# EAGLE design chipchestra-v05-buttons (EAGLE 8.0.1)
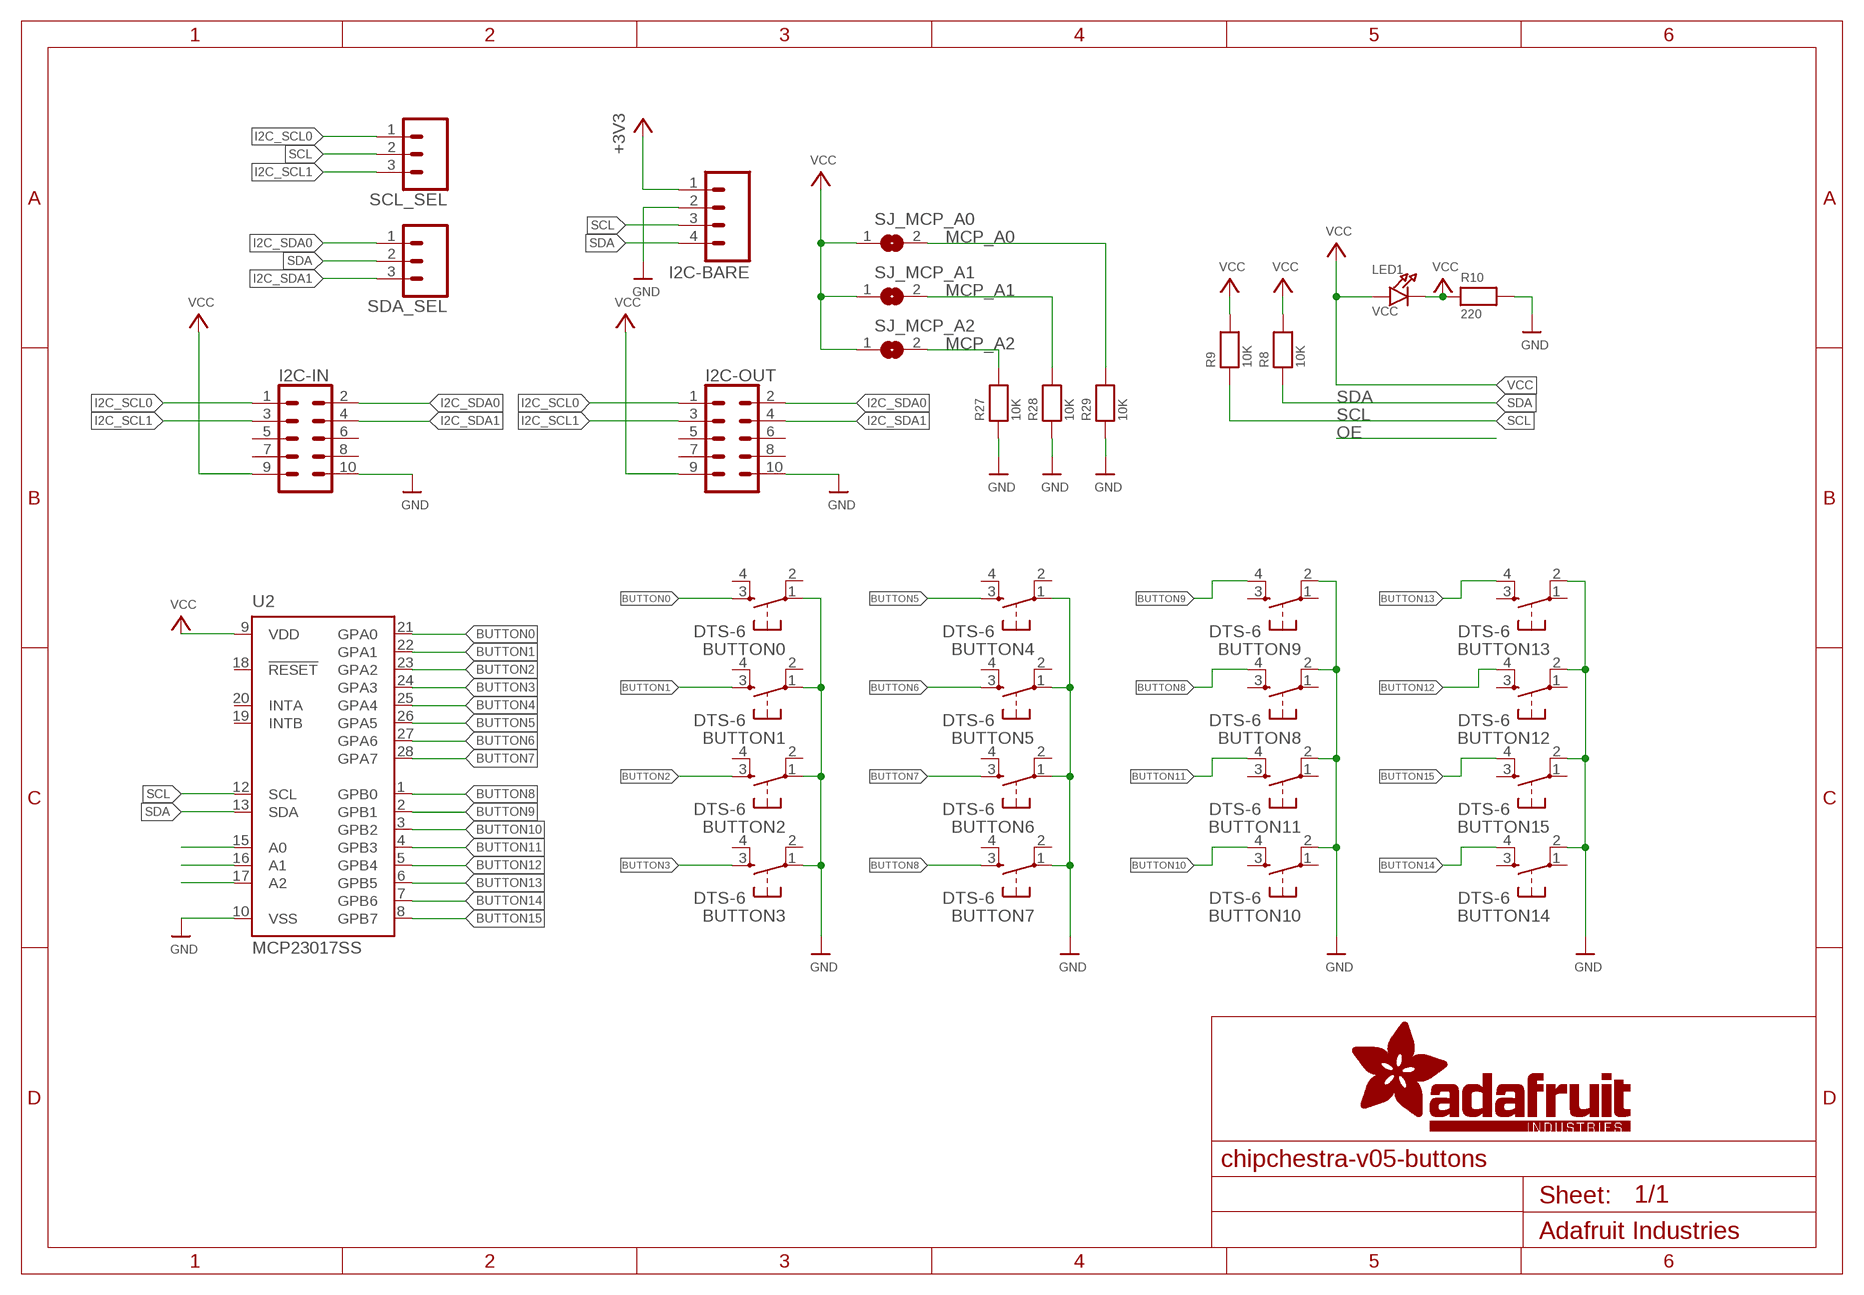
[diagram p0: schematic, sheet 1]

## Parts
BUTTON0  DTS-6  [DTS-6]
BUTTON1  DTS-6  [DTS-6]
BUTTON2  DTS-6  [DTS-6]
BUTTON3  DTS-6  [DTS-6]
BUTTON4  DTS-6  [DTS-6]
BUTTON5  DTS-6  [DTS-6]
BUTTON6  DTS-6  [DTS-6]
BUTTON7  DTS-6  [DTS-6]
BUTTON8  DTS-6  [DTS-6]
BUTTON9  DTS-6  [DTS-6]
BUTTON10  DTS-6  [DTS-6]
BUTTON11  DTS-6  [DTS-6]
BUTTON12  DTS-6  [DTS-6]
BUTTON13  DTS-6  [DTS-6]
BUTTON14  DTS-6  [DTS-6]
BUTTON15  DTS-6  [DTS-6]
I2C-BARE  M04LOCK  [1X04_LOCK]
I2C-IN  CONN_05X2SHD_LOCK  [2X5-SHROUDED_LOCK]
I2C-OUT  CONN_05X2SHD_LOCK  [2X5-SHROUDED_LOCK]
LED1  VCC  LED0805  [CHIPLED_0805]
R8  10K  RESISTOR0805  [0805]
R9  10K  RESISTOR0805  [0805]
R10  220  RESISTOR0805  [0805]
R27  10K  RESISTOR0805  [0805]
R28  10K  RESISTOR0805  [0805]
R29  10K  RESISTOR0805  [0805]
SCL_SEL  CONN_03LOCK  [1X03_LOCK]
SDA_SEL  CONN_03LOCK  [1X03_LOCK]
SJ_MCP_A0  SOLDERJUMPERREFLOW_NOPASTE  [SOLDERJUMPER_REFLOW_NOPASTE]
SJ_MCP_A1  SOLDERJUMPERREFLOW_NOPASTE  [SOLDERJUMPER_REFLOW_NOPASTE]
SJ_MCP_A2  SOLDERJUMPERREFLOW_NOPASTE  [SOLDERJUMPER_REFLOW_NOPASTE]
U2  MCP23017SS  [SSOP28]

## Nets
+3V3: I2C-BARE.1
BUTTON0: BUTTON0.3 U2.21(GPA0)
BUTTON1: BUTTON1.3 U2.22(GPA1)
BUTTON2: BUTTON2.3 U2.23(GPA2)
BUTTON3: BUTTON3.3 U2.24(GPA3)
BUTTON4: U2.25(GPA4)
BUTTON5: BUTTON4.3 U2.26(GPA5)
BUTTON6: BUTTON5.3 U2.27(GPA6)
BUTTON7: BUTTON6.3 U2.28(GPA7)
BUTTON8: BUTTON7.3 BUTTON8.4 U2.1(GPB0)
BUTTON9: BUTTON9.4 U2.2(GPB1)
BUTTON10: BUTTON10.4 U2.3(GPB2)
BUTTON11: BUTTON11.4 U2.4(GPB3)
BUTTON12: BUTTON12.4 U2.5(GPB4)
BUTTON13: BUTTON13.4 U2.6(GPB5)
BUTTON14: BUTTON14.4 U2.7(GPB6)
BUTTON15: BUTTON15.4 U2.8(GPB7)
GND: BUTTON0.1 BUTTON1.1 BUTTON2.1 BUTTON3.1 BUTTON4.1 BUTTON5.1 BUTTON6.1 BUTTON7.1 BUTTON8.2 BUTTON9.2 BUTTON10.2 BUTTON11.2 BUTTON12.2 BUTTON13.2 BUTTON14.2 BUTTON15.2 I2C-BARE.2 I2C-IN.10 I2C-OUT.10 R10.2 R27.1 R28.1 R29.1 U2.10(VSS)
I2C_SCL0: I2C-IN.1 I2C-OUT.1 SCL_SEL.1
I2C_SCL1: I2C-IN.3 I2C-OUT.3 SCL_SEL.3
I2C_SDA0: I2C-IN.2 I2C-OUT.2 SDA_SEL.1
I2C_SDA1: I2C-IN.4 I2C-OUT.4 SDA_SEL.3
MCP_A0: R29.2 SJ_MCP_A0.2 U2.15(A0)
MCP_A1: R28.2 SJ_MCP_A1.2 U2.16(A1)
MCP_A2: R27.2 SJ_MCP_A2.2 U2.17(A2)
N$1: LED1.C R10.1 ; supply symbol labelled VCC
SCL: I2C-BARE.3 R9.1 SCL_SEL.2 U2.12(SCL)
SDA: I2C-BARE.4 R8.1 SDA_SEL.2 U2.13(SDA)
VCC: I2C-IN.9 I2C-OUT.9 LED1.A R8.2 R9.2 SJ_MCP_A0.1 SJ_MCP_A1.1 SJ_MCP_A2.1 U2.9(VDD)
Unconnected: BUTTON0.2 BUTTON0.4 BUTTON1.2 BUTTON1.4 BUTTON2.2 BUTTON2.4 BUTTON3.2 BUTTON3.4 BUTTON4.2 BUTTON4.4 BUTTON5.2 BUTTON5.4 BUTTON6.2 BUTTON6.4 BUTTON7.2 BUTTON7.4 BUTTON8.1 BUTTON8.3 BUTTON9.1 BUTTON9.3 BUTTON10.1 BUTTON10.3 BUTTON11.1 BUTTON11.3 BUTTON12.1 BUTTON12.3 BUTTON13.1 BUTTON13.3 BUTTON14.1 BUTTON14.3 BUTTON15.1 BUTTON15.3 I2C-IN.5 I2C-IN.6 I2C-IN.7 I2C-IN.8 I2C-OUT.5 I2C-OUT.6 I2C-OUT.7 I2C-OUT.8 U2.18(!RESET) U2.19(INTB) U2.20(INTA)

## Library data of the parts
BUTTON0 BUTTON1-BUTTON15 = switch-tact:DTS-6
I2C-BARE = CMU-ArtFab:M04: Header 4 Standard 4-pin 0.1" header. Use with straight break away headers (SKU : PRT-00116), right angle break away headers (PRT-00553), swiss pins (PRT-00743), machine pins (PRT-00117), and female headers (PRT-00115). Molex polarized connector foot print use with SKU : PRT-08231 with associated crimp pins and housings. 1MM SMD Version SKU: PRT-10208
I2C-IN I2C-OUT = SparkFun-Connectors:CONN_05X2: Multi connection point. Often used as Generic Header-pin footprint for 0.1 inch spaced/style header connections For AVR SPI programming port, see special device with nice symbol: "AVR_SPI_PROG_5x2.dev" You can populate with any combo of single row headers, but if you'd like an exact match, check these: 2x5 AVR ICSP Male Header <https://www.sparkfun.com/products/778> (PRT-00778) 2x5 Pin Shrouded Header <https://www.sparkfun.com/products/8506> (PRT-08506) On any of the 0.1 inch spaced packages, you can populate with these: Break Away Headers - Straight <https://www.sparkfun.com/products/116> (PRT-00116) Break Away Male Headers - Right Angle <https://www.sparkfun.com/products/553> (PRT-00553) Female Headers <https://www.sparkfun.com/products/115> (PRT-00115) Break Away Headers - Machine Pin <https://www.sparkfun.com/products/117> (PRT-00117) Break Away Female Headers - Swiss Machine Pin <https://www.sparkfun.com/products/743> (PRT-00743) Special note: the shrouded connector mates well with our 5x2 ribbon cables: 2x5 Pin IDC Ribbon Cable <https://www.sparkfun.com/products/8535> (PRT-08535); PROD_ID: CONN-08671; SF_ID: PRT-08506
LED1 = microbuilder:LED: LED 0603 - 0603 Surface Mount Package 2mA: Green LED - Low Power (3.9mcd, 2ma, 1.7Vf) - Digikey: 475-2709-2-ND Orange LED - Low Power (9.8mcd, 2ma, 1.8Vf) - Digikey: 475-1194-2-ND Red LED - Low Power (5mcd, 2ma, 1.8Vf) - Digikey: 475-1195-2-ND Yellow LED - Low Power (7mcd, 2ma, 1.8Vf) - Digikey: 475-1196-2-ND 5mA: Blue LED - Low Power (17mcd, 5ma, 2.9Vf) - Digikey: LNJ937W8CRACT-ND 0805 - 0805 Surface Mount Package 2mA: Red LED (8.8mcd, 2mA, 1.8Vf, Clear) - Low Power [Digikey: 475-2510-1-ND] Green LED (5mcd, 2mA, 1.8Vf, Clear) - Low Power [Digikey: 475-2730-1-ND] Yellow LED (11.3mcd, 2mA, 1.8Vf, Clear) - Low Power [Digikey: 475-2555-1-ND] 20mA: Red LED (104mcd, 20mA, Diffused) - LS R976 [Digikey: 475-1278-6-ND] Red LED (12mcd, 20mA, 2.0Vf, Clear) - APT2012EC [Digikey: 754-1128-1-ND] Green LED (15mcd, 20mA, 2.2Vf, Clear) - APT2012GC [Digikey: 754-1131-1-ND] Orange LED (160mcd, 20mA, 2.1Vf, Clear) - APT2012SECK [Digikey: 754-1130-1-ND] 1206 - 1206 Surface Mount Package Green LED (26mcd, 20mA, Diffused) - LG N971 [Digikey: 475-1407-6-ND] Red LED (15mcd, 20mA, Diffused) - LH N974 [Digikey: 475-1416-6-ND]
R8-R10 R27-R29 = microbuilder:RESISTOR: Resistors 0402 - 0402 Surface Mount Package 22 Ohm 1% 1/16W [Digikey: 311-22.0LRTR-ND] 33 Ohm 5% 1/16W 1.0K 5% 1/16W 1.5K 5% 1/16W 2.0K 1% 1/16W 10.0K 1% 1/16W [Digikey: 311-10.0KLRTR-ND] 10.0K 5% 1/16W [Digikey: RMCF0402JT10K0TR-ND] 12.1K 1% 1/16W [Digikey: 311-22.0LRTR-ND] 100.0K 5% 1/16W 0603 - 0603 Surface Mount Package 0 Ohm 1/10 Watt 1% Resistor 15 Ohm 1/10 Watt 1% Resistor 33 Ohm 1/10 Watt 1% Resistor 49.9 Ohm 1/10 Watt 1% Resistor 100 Ohm 1/10 Watt 1% Resistor 150 Ohm 1/10 Watt 1% Resistor 240 Ohm 1/10 Watt 1% Resistor 390 Ohm 1/10 Watt 1% Resistor 560 Ohm 1/10 Watt 1% Resistor 680 Ohm 1/10 Watt 1% Resistor 750 Ohm 1/10 Watt 1% Resistor 1.0K Ohm 1/10 Watt 1% Resistor 1.5K Ohm 1/10 Watt 1% Resistor 2.0K Ohm 1/10 Watt 1% Resistor 2.2K Ohm 1/10 Watt 1% Resistor 3.3K Ohm 1/10 Watt 1% Resistor 4.7K Ohm 1/10 Watt 1% Resistor 10.0K Ohm 1/10 Watt 1% Resistor 12.0K Ohm 1/10 Watt 1% Resistor 12.1K Ohm 1/10 Watt 1% Resistor 20.0K Ohm 1/10 Watt 1% Resistor 33.0K Ohm 1/10 Watt 1% Resistor 100.0K Ohm 1/10 Watt 1% Resistor 0805 - 0805 Surface Mount Package 0 Ohm 1/8 Watt 1% Resistor 33 Ohm 1/8 Watt 1% Resistor 100 Ohm 1/8 Watt 1% Resistor 150 Ohm 1/8 Watt 1% Resistor 200 Ohm 1/8 Watt 1% Resistor 240 Ohm 1/8 Watt 1% Resistor 330 Ohm 1/8 Watt 1% Resistor 390 Ohm 1/8 Watt 1% Resistor 470 Ohm 1/8 Watt 1% Resistor 1.0K Ohm 1/8 Watt 1% Resistor 1.5K Ohm 1/8 Watt 1% Resistor 2.0K Ohm 1/8 Watt 1% Resistor 4.7K Ohm 1/8 Watt 1% Resistor 5.1K Ohm 1/8 Watt 1% Resistor 5.6K Ohm 1/8 Watt 1% Resistor 10.0K Ohm 1/8 Watt 1% Resistor 22.0K Ohm 1/8 Watt 1% Resistor 33.0K Ohm 1/8 Watt 1% Resistor 100K Ohm 1/8 Watt 1% Resistor 1206 - 1206 Surface Mount Package 2012 - 2010 Surface Mount Package 0.11 Ohm 1/2 Watt 1% Resistor - Digikey: RHM.11UCT-ND
SCL_SEL SDA_SEL = SparkFun-Connectors:CONN_03: Multi connection point. Often used as Generic Header-pin footprint for 0.1 inch spaced/style header connections On any of the 0.1 inch spaced packages, you can populate with these: Break Away Headers - Straight <https://www.sparkfun.com/products/116> (PRT-00116) Break Away Male Headers - Right Angle <https://www.sparkfun.com/products/553> (PRT-00553) Female Headers <https://www.sparkfun.com/products/115> (PRT-00115) Break Away Headers - Machine Pin <https://www.sparkfun.com/products/117> (PRT-00117) Break Away Female Headers - Swiss Machine Pin <https://www.sparkfun.com/products/743> (PRT-00743) Stackable Header - 3 Pin (Female, 0.1") <https://www.sparkfun.com/products/13875> (PRT-13875) For SCREWTERMINALS and SPRING TERMINALS visit here: Screw Terimnals on SparkFun.com <https://www.sparkfun.com/search/results?term=Screw+Terminals> (5mm/3.5mm/2.54mm spacing) This device is also useful as a general connection point to wire up your design to another part of your project. Our various solder wires solder well into these plated through hole pads. Hook-Up Wire - Assortment (Stranded, 22 AWG) <https://www.sparkfun.com/products/11375> (PRT-11375) Hook-Up Wire - Assortment (Solid Core, 22 AWG) <https://www.sparkfun.com/products/11367> (PRT-11367) View the entire wire category on our website here <https://www.sparkfun.com/categories/141> Special notes: Molex polarized connector foot print use with SKU : PRT-08232 with associated crimp pins and housings.
SJ_MCP_A0 SJ_MCP_A1 SJ_MCP_A2 = microbuilder:SOLDERJUMPER: SMD Solder JUMPER Solder the two pads together to create a connection, or remove the solder to break it. REFLOW - Use this footprint for solder paste and reflow ovens. WAVE - Use this footprint for hand-soldering (larger pads). CLOSED - Has a trace between the two pads to ensure it is closed by default. The trace needs to be cut to disable the jumper, and can be closed again by creating a solder bridge between the two pads.
U2 = microchip:MCP23017: http://ww1.microchip.com/downloads/en/DeviceDoc/21952a.pdf Source: http://ww1.microchip.com/downloads/en/DeviceDoc/21952a.pdf; MF: MICROCHIP; MPN: MCP23017-E/SS; OC_FARNELL: 1467674; OC_NEWARK: 31K2960

## Net classes
0 default: width 0.203 mm, clearance 0.152 mm

## Board
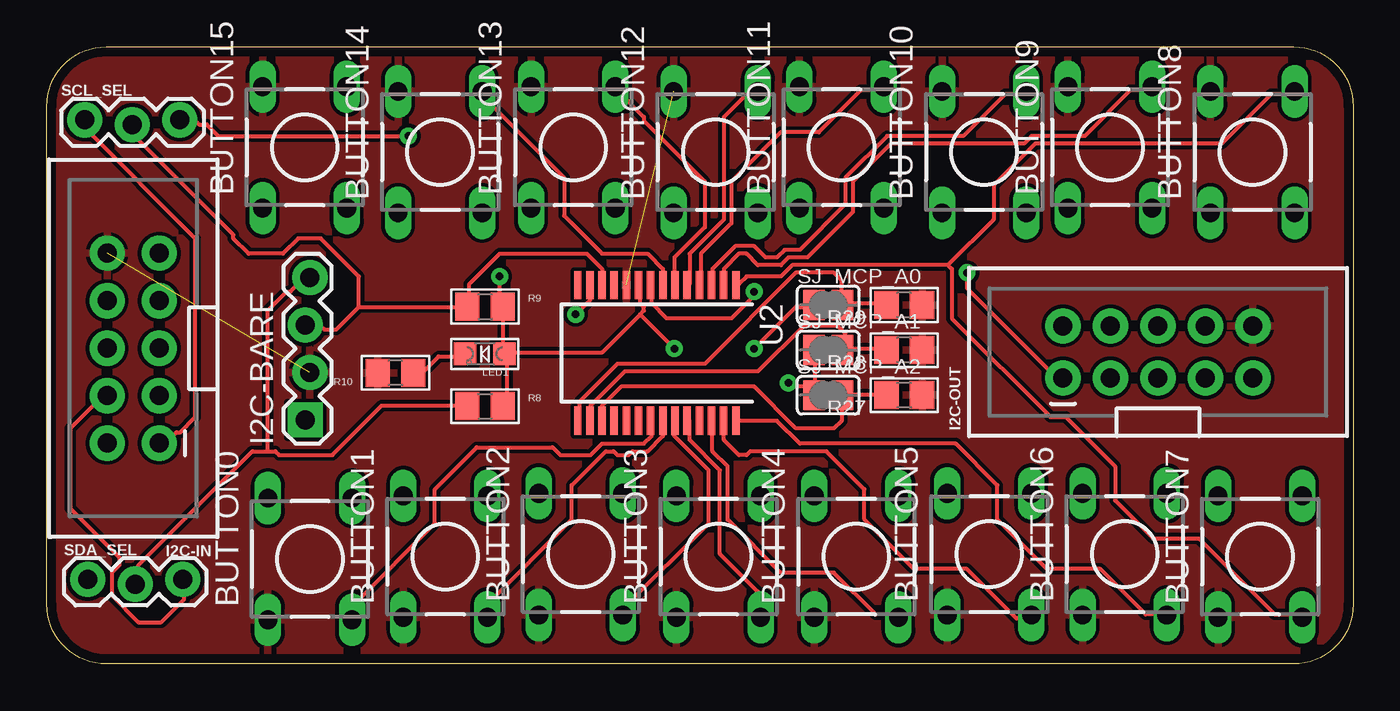
[diagram p1: board, top side]
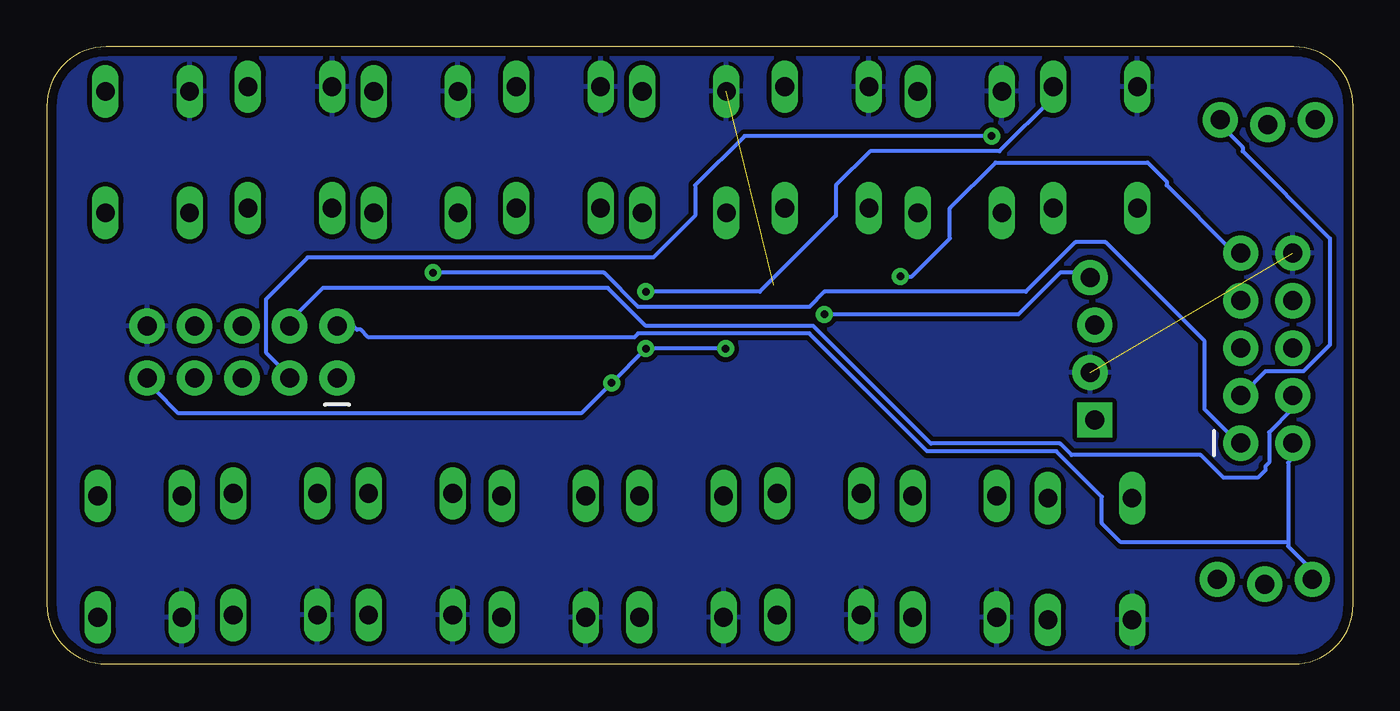
[diagram p2: board, bottom side, seen from below]

Size 69.85 x 33.02 mm. Coordinates in mm from the lower left corner, seen from the top.
Outline: 3.17,0 arc-90 0,3.17 0,29.84 arc-90 3.17,33.02 66.67,33.02 arc-90 69.85,29.84 69.85,3.17 arc-90 66.67,0 3.17,0
Copper layers (1*16): Top 0.035mm / dielectric 1.5mm / Bottom 0.035mm
Design rules "PCBCart-Standard *": minimum track width 8mil, minimum drill 0.4mm, track to track 8mil, track to pad 8mil, pad to pad 8mil, via to via 8mil, smd to smd 8mil, copper to edge 20mil, drill to drill 8mil, minimum pad ring 8mil, minimum via ring 10mil, stop-mask expansion 3mil, vias tented up to drill 20mil, thermal gap 8mil

### Footprints (pad centres in the part's own frame; a part is rotated, then mirrored left to right if it is on the bottom)
DTS-6 = drill 1 long: 1 -3.25,2.25; 2 3.25,2.25; 3 -3.25,-2.25; 4 3.25,-2.25
1X04_LOCK = drill 1.016 pad 1.88 square: 1 0,0.127 | drill 1.016 pad 1.88: 2 2.54,-0.127; 3 5.08,0.127; 4 7.62,-0.127
2X5-SHROUDED_LOCK = drill 1.016 pad 1.88: 1 -1.397,5.08; 2 1.397,5.08; 3 -1.397,2.54; 4 1.397,2.54; 5 -1.397,0; 6 1.397,0; 7 -1.397,-2.54; 8 1.397,-2.54; 9 -1.397,-5.08; 10 1.397,-5.08
CHIPLED_0805 = smd 1.2 x 1.2: A 0,-1.05; C 0,1.05
0805 = smd 1.3 x 1.5: 1 -0.95,0; 2 0.95,0
1X03_LOCK = drill 1.016 pad 1.88: 1 0,0.127; 2 2.54,-0.127; 3 5.08,0.127
SOLDERJUMPER_REFLOW_NOPASTE = smd 1.168 x 1.6: 1 -0.762,0; 2 0.762,0
SSOP28 = smd 0.4 x 1.5: 1 -4.225,-3.625; 2 -3.575,-3.625; 3 -2.925,-3.625; 4 -2.275,-3.625; 5 -1.625,-3.625; 6 -0.975,-3.625; 7 -0.325,-3.625; 8 0.325,-3.625; 9 0.975,-3.625; 10 1.625,-3.625; 11 2.275,-3.625; 12 2.925,-3.625; 13 3.575,-3.625; 14 4.225,-3.625; 15 4.225,3.625; 16 3.575,3.625; 17 2.925,3.625; 18 2.275,3.625; 19 1.625,3.625; 20 0.975,3.625; 21 0.325,3.625; 22 -0.325,3.625; 23 -0.975,3.625; 24 -1.625,3.625; 25 -2.275,3.625; 26 -2.925,3.625; 27 -3.575,3.625; 28 -4.225,3.625

### Placement (x,y rotation side)
BUTTON0  14.07,5.61 90 top
BUTTON1  21.31,5.74 90 top
BUTTON2  28.55,5.87 90 top
BUTTON3  35.92,5.74 90 top
BUTTON4  43.28,5.74 90 top
BUTTON5  50.39,5.87 90 top
BUTTON6  57.63,5.87 90 top
BUTTON7  64.87,5.74 90 top
BUTTON8  64.47,27.38 90 top
BUTTON9  56.85,27.64 90 top
BUTTON10  50.11,27.38 90 top
BUTTON11  42.49,27.64 90 top
BUTTON12  35.76,27.38 90 top
BUTTON13  28.14,27.64 90 top
BUTTON14  21.03,27.38 90 top
BUTTON15  13.79,27.64 90 top
I2C-BARE  13.94,13.06 90 top
I2C-IN  4.62,16.89 180 top
I2C-OUT  59.41,16.69 90 top
LED1  23.42,16.59 90 top
R8  23.43,13.79 0 top
R9  23.43,19.12 0 top
R10  18.64,15.57 180 top
R27  45.85,14.38 180 top
R28  45.85,16.79 180 top
R29  45.85,19.2 180 top
SCL_SEL  2.03,28.98 0 top
SDA_SEL  2.18,4.39 0 top
SJ_MCP_A0  41.78,19.2 0 top
SJ_MCP_A1  41.78,16.79 0 top
SJ_MCP_A2  41.78,14.38 0 top
U2  32.61,16.64 180 top

### Tracks (layer width: path | path; a pad name or v marks a point on that pad's centre or on a via)
BUTTON0
  Top 0.203: U2.21 32.33,13.01 32.33,12.19 31.93,11.79 29.69,11.79 29.08,11.18 27.46,11.18 27.05,11.58 22.99,11.58 20.75,9.35 20.75,7.52 16.48,3.25 16.48,2.44 BUTTON0.3
BUTTON1
  Top 0.203: U2.22 32.94,12.19 32.13,11.38 31.32,11.38 31.11,11.18 30.5,11.18 30.3,11.38 29.9,11.38 28.07,9.55 28.07,7.72 23.6,3.25 23.6,2.64 BUTTON1.3
BUTTON2
  Top 0.203: U2.23 33.55,13.01 33.55,12.19 35.38,10.36 35.38,7.52 30.91,3.05 30.91,2.64 BUTTON2.3
BUTTON3
  Top 0.203: U2.24 34.37,13.01 34.37,11.99 35.99,10.36 35.99,5.89 38.02,3.86 38.02,2.64 BUTTON3.3
BUTTON5
  Top 0.203: U2.26 35.59,13.01 35.59,11.38 36.4,10.57 36.4,7.72 39.24,4.88 42.09,4.88 44.32,2.64 45.34,2.64 BUTTON4.3
BUTTON6
  Top 0.203: U2.27 36.2,11.99 37.01,11.18 37.41,11.18 37.62,11.38 41.68,11.38 43.71,9.35 43.71,7.72 46.35,5.08 49.2,5.08 51.84,2.44 52.45,2.44 BUTTON5.3
BUTTON7
  Top 0.203: U2.28 37.01,13.01 39.04,13.01 40.26,11.79 48.59,11.79 50.83,9.55 50.83,7.72 53.47,5.08 56.31,5.08 58.75,2.64 59.77,2.64 BUTTON6.3
BUTTON8
  Top 0.203: 48.18,21.34 39.85,21.34 39.24,20.73 37.41,20.73 37.01,20.32 U2.1 | 48.18,21.34 50.62,23.77 50.62,25.6 52.86,27.84 62.81,27.84 65.46,30.48 66.67,30.48 BUTTON8.4 | 48.18,21.34 48.39,21.13 48.39,18.49 53.67,13.21 54.48,13.21 57.12,10.57 57.12,8.74 59.16,6.71 61.59,6.71 65.66,2.64 67.08,2.64 BUTTON7.3
BUTTON9
  Top 0.203: U2.2 36.2,20.32 36.2,21.13 37.01,21.95 37.41,21.95 38.02,21.34 39.24,21.34 39.65,21.74 40.66,21.74 43.1,24.18 43.1,25.81 45.14,27.84 52.25,27.84 52.65,28.25 55.5,28.25 57.94,30.68 58.95,30.68 BUTTON9.4
BUTTON10
  Top 0.203: U2.3 35.59,20.32 35.59,21.13 36.8,22.35 37.82,22.35 38.43,21.74 39.04,21.74 39.45,22.15 40.26,22.15 42.7,24.59 42.7,26.01 44.93,28.25 49,28.25 51.23,30.48 52.25,30.48 BUTTON10.4
BUTTON11
  Top 0.203: U2.4 34.98,20.32 34.98,21.95 36.6,23.57 36.6,25.81 39.24,28.45 41.27,28.45 43.51,30.68 44.73,30.68 BUTTON11.4
BUTTON12
  Top 0.203: U2.5 34.37,20.32 34.37,21.95 36.2,23.77 36.2,29.26 37.41,30.48 37.82,30.48 BUTTON12.4
BUTTON13
  Top 0.203: U2.6 33.55,20.32 33.55,21.74 35.18,23.37 35.18,25.81 31.93,29.06 31.93,29.26 30.5,30.68 BUTTON13.4
BUTTON14
  Top 0.203: U2.7 32.94,20.32 32.94,21.13 32.13,21.95 29.69,21.95 27.66,23.98 27.66,26.01 23.19,30.48 BUTTON14.4
BUTTON15  (via drill 0.4)
  Top 0.203: v37.82,19.91 37.82,19.71 36.6,18.49 33.15,18.49 32.33,19.3 32.33,20.12 U2.8
  Bottom 0.203: v37.82,19.91 31.72,19.91 27.66,23.98 27.66,25.6 25.83,27.43 18.92,27.43 16.08,30.28 16.08,30.68 BUTTON15.4
GND  (2 unrouted)
  pour Bottom (isolate 0.254): -0.81,-1.07 -0.66,33.68 70.4,33.56 70.4,-0.99
  pour Top: 71.75,35.56 -1.91,35.56 -1.91,-2.54 71.75,-2.54
I2C_SCL0  (via drill 0.4)
  Top 0.203: SCL_SEL.1 2.06,29.06 2.06,28.65 7.95,22.76 7.95,13.21 7.14,12.39 6.93,12.39 6.53,11.99 6.12,11.99 I2C-IN.1 | v49.2,20.93 49.2,20.12 53.87,15.44 54.28,15.44 I2C-OUT.1
  Bottom 0.203: v49.2,20.93 40.06,20.93 38.23,19.1 29.08,19.1 28.27,19.91 17.5,19.91 14.86,22.55 13.23,22.55 7.95,17.27 7.95,13.61 6.12,11.79 I2C-IN.1
I2C_SCL1  (via drill 0.4)
  Top 0.203: v19.33,28.25 9.17,28.25 8.56,28.85 8.15,28.85 7.95,29.06 7.14,29.06 SCL_SEL.3
  Bottom 0.203: I2C-IN.3 5.92,14.43 4.7,15.65 2.67,15.65 1.24,17.07 1.24,22.76 5.92,27.43 5.92,27.64 6.93,28.65 6.93,29.06 SCL_SEL.3 | v19.33,28.25 32.54,28.25 35.18,25.6 35.18,23.98 37.41,21.74 55.91,21.74 58.14,19.51 58.14,16.66 56.92,15.44 I2C-OUT.3
I2C_SDA0
  Bottom 0.203: 3.48,6.5 3.48,10.77 3.28,10.97 3.28,11.79 I2C-IN.2 | 3.48,6.5 3.48,6.3 2.26,5.08 2.26,4.67 SDA_SEL.1 | I2C-OUT.2 53.47,18.09 53.26,17.88 53.06,17.88 52.65,17.48 38.43,17.48 38.23,17.68 29.08,17.68 22.78,11.38 15.87,11.38 13.44,8.94 13.44,7.52 12.42,6.5 3.48,6.5
I2C_SDA1
  Top 0.203: SDA_SEL.3 7.34,4.47 7.34,3.45 6.12,2.23 4.9,2.23 3.48,3.66 3.48,4.88 3.89,5.28 3.89,5.69 1.24,8.33 1.24,12.6 3.07,14.43 I2C-IN.4
  Bottom 0.203: I2C-OUT.4 56.72,18.09 56.72,18.49 55.09,20.12 39.85,20.12 37.82,18.09 28.88,18.09 22.58,11.79 15.67,11.79 15.06,11.18 8.15,11.18 6.93,9.96 5.1,9.96 4.7,10.36 4.7,10.57 4.5,10.77 4.5,12.39 3.28,13.61 3.28,14.22 I2C-IN.4
MCP_A0
  Top 0.203: U2.15 28.47,13.21 28.47,14.02 30.5,16.05 35.18,16.05 40.06,20.93 42.09,20.93 42.49,20.52 42.49,19.3 SJ_MCP_A0.2 42.7,19.3 44.73,19.3 R29.2
MCP_A1
  Top 0.203: 42.7,16.87 42.7,17.68 42.29,18.09 40.46,18.09 38.02,15.65 30.91,15.65 29.08,13.82 29.08,13.21 U2.16 | 42.7,16.87 44.73,16.87 R28.2 | 42.7,16.87 SJ_MCP_A1.2
MCP_A2
  Top 0.203: U2.17 29.69,13.21 29.69,13.82 30.71,14.83 37.82,14.83 40.06,12.6 42.09,12.6 42.49,13.01 42.49,14.22 SJ_MCP_A2.2 42.7,14.43 44.73,14.43 R27.2
N$1
  Top 0.203: LED1.C 22.17,16.46 20.95,16.46 20.14,15.65 19.74,15.65 R10.1
SCL
  Top 0.203: 16.69,19.1 22.38,19.1 R9.1 22.58,19.3 22.58,20.32 24.21,21.95 28.88,21.95 29.69,21.13 29.69,20.32 U2.12 | 16.69,19.1 15.47,17.88 14.86,17.88 14.66,18.09 13.84,18.09 I2C-BARE.3 | 16.69,19.1 16.69,20.73 14.66,22.76 13.44,22.76 12.62,21.95 10.79,21.95 9.98,22.76 9.98,22.96 4.7,28.25 4.7,28.85 SCL_SEL.2
SDA  (via drill 0.4)
  Top 0.203: v28.27,18.69 29.08,19.51 29.08,20.12 U2.13 | 11.81,11.38 11,11.38 4.9,5.28 4.9,4.27 SDA_SEL.2 | 11.81,11.38 12.22,11.38 12.42,11.18 15.26,11.18 17.91,13.82 22.38,13.82 R8.1 | 11.81,11.38 11.81,18.9 12.83,19.91 13.03,19.91 13.64,20.52 14.05,20.52 I2C-BARE.4
  Bottom 0.203: v28.27,18.69 17.91,18.69 15.67,20.93 14.45,20.93 14.25,20.73 I2C-BARE.4
VCC  (via drill 0.4)
  Top 0.203: 41.07,14.83 41.07,16.66 SJ_MCP_A1.1 | 41.07,14.83 41.07,14.43 SJ_MCP_A2.1 41.07,14.83 | v37.82,16.87 40.06,19.1 40.87,19.1 SJ_MCP_A0.1 | v39.65,15.04 39.85,14.83 41.07,14.83 | LED1.A 24.61,16.46 24.61,14.02 24.41,13.82 R8.2 | LED1.A 24.41,16.66 24.41,19.1 R9.2 24.21,19.3 v24.21,20.73 | 31.72,18.69 29.69,16.66 24.61,16.66 LED1.A | 31.72,18.69 31.93,18.9 31.93,19.1 31.72,19.3 31.72,20.12 U2.9 | 31.72,18.69 v33.55,16.87
  Bottom 0.203: I2C-OUT.9 64.03,14.83 64.03,14.63 62.81,13.41 41.27,13.41 v39.65,15.04 v37.82,16.87 v33.55,16.87 | v24.21,20.73 23.6,20.73 21.56,22.76 21.56,24.38 19.13,26.82 11,26.82 9.98,25.81 9.98,25.6 6.53,22.15 6.12,22.15 I2C-IN.9